# EAGLE design GroundStation (EAGLE 7.7.0)
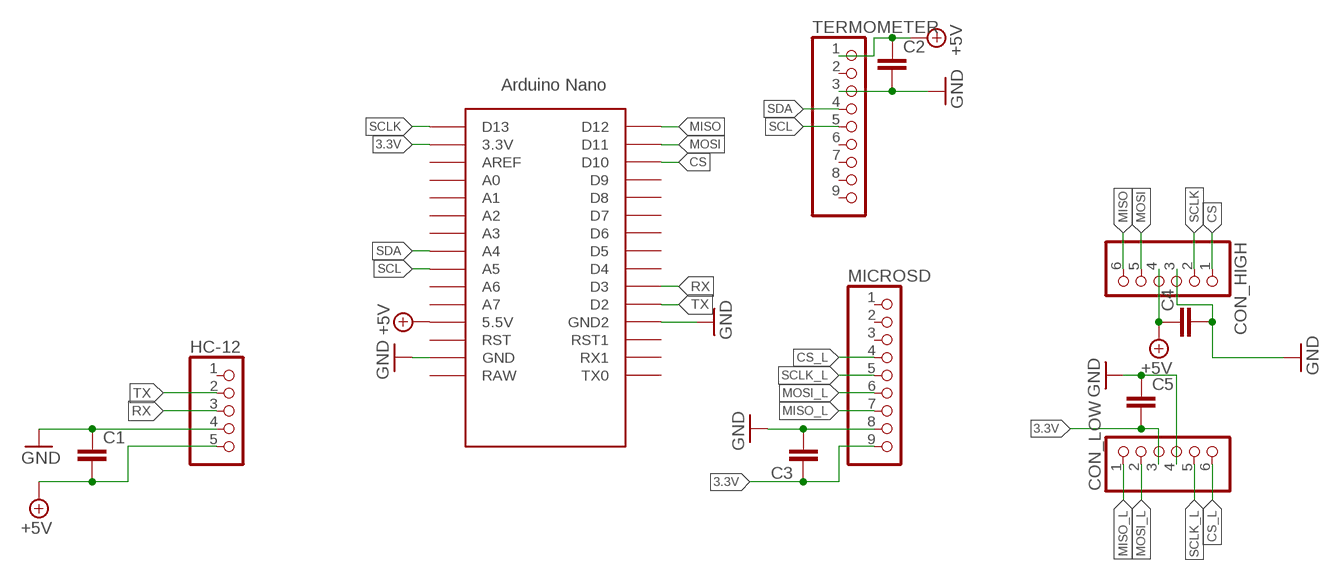
[diagram p0: schematic, sheet 1]

## Parts
C1  C-EU050-025X075  [C050-025X075]
C2  C-EU050-025X075  [C050-025X075]
C3  C-EU050-025X075  [C050-025X075]
C4  C-EU050-025X075  [C050-025X075]
C5  C-EU050-025X075  [C050-025X075]
CON_HIGH  PINHD-1X6  [1X06]
CON_LOW  PINHD-1X6  [1X06]
HC-12  PINHD-1X5  [1X05]
MICROSD  PINHD-1X9  [1X09]
TERMOMETER  PINHD-1X9  [1X09]
U$1  NANO  [NANO]

## Nets
3.3V: C3.1 C5.2 CON_LOW.3 MICROSD.9 U$1.3.3V
+5V: C1.2 C2.1 C4.1 CON_HIGH.4 HC-12.5 TERMOMETER.1 U$1.5V(5.5V)
CS: CON_HIGH.1 U$1.D10
CS_L: CON_LOW.6 MICROSD.4
GND: C1.1 C2.2 C3.2 C4.2 C5.1 CON_HIGH.3 CON_LOW.4 HC-12.4 MICROSD.8 TERMOMETER.3 U$1.GND U$1.GND1(GND2)
MISO: CON_HIGH.6 U$1.D12
MISO_L: CON_LOW.1 MICROSD.7
MOSI: CON_HIGH.5 U$1.D11
MOSI_L: CON_LOW.2 MICROSD.6
RX: HC-12.3 U$1.D3
SCL: TERMOMETER.5 U$1.A5
SCLK: CON_HIGH.2 U$1.D13
SCLK_L: CON_LOW.5 MICROSD.5
SDA: TERMOMETER.4 U$1.A4
TX: HC-12.2 U$1.D2
Unconnected: HC-12.1 MICROSD.1 MICROSD.2 MICROSD.3 TERMOMETER.2 TERMOMETER.6 TERMOMETER.7 TERMOMETER.8 TERMOMETER.9 U$1.A0 U$1.A1 U$1.A2 U$1.A3 U$1.A6 U$1.A7 U$1.AREF U$1.D4 U$1.D5 U$1.D6 U$1.D7 U$1.D8 U$1.D9 U$1.ICSP1 U$1.ICSP2 U$1.ICSP3 U$1.ICSP4 U$1.ICSP5 U$1.ICSP6 U$1.RAW U$1.RST U$1.RST1 U$1.RX1 U$1.TX0

## Library data of the parts
C1-C5 = resistor:C-EU: CAPACITOR, European symbol
CON_HIGH CON_LOW = pinhead:PINHD-1X6: PIN HEADER
HC-12 = pinhead:PINHD-1X5: PIN HEADER
MICROSD TERMOMETER = pinhead:PINHD-1X9: PIN HEADER
U$1 = Arduino-clone:NANO: Arduino Nano

## Board
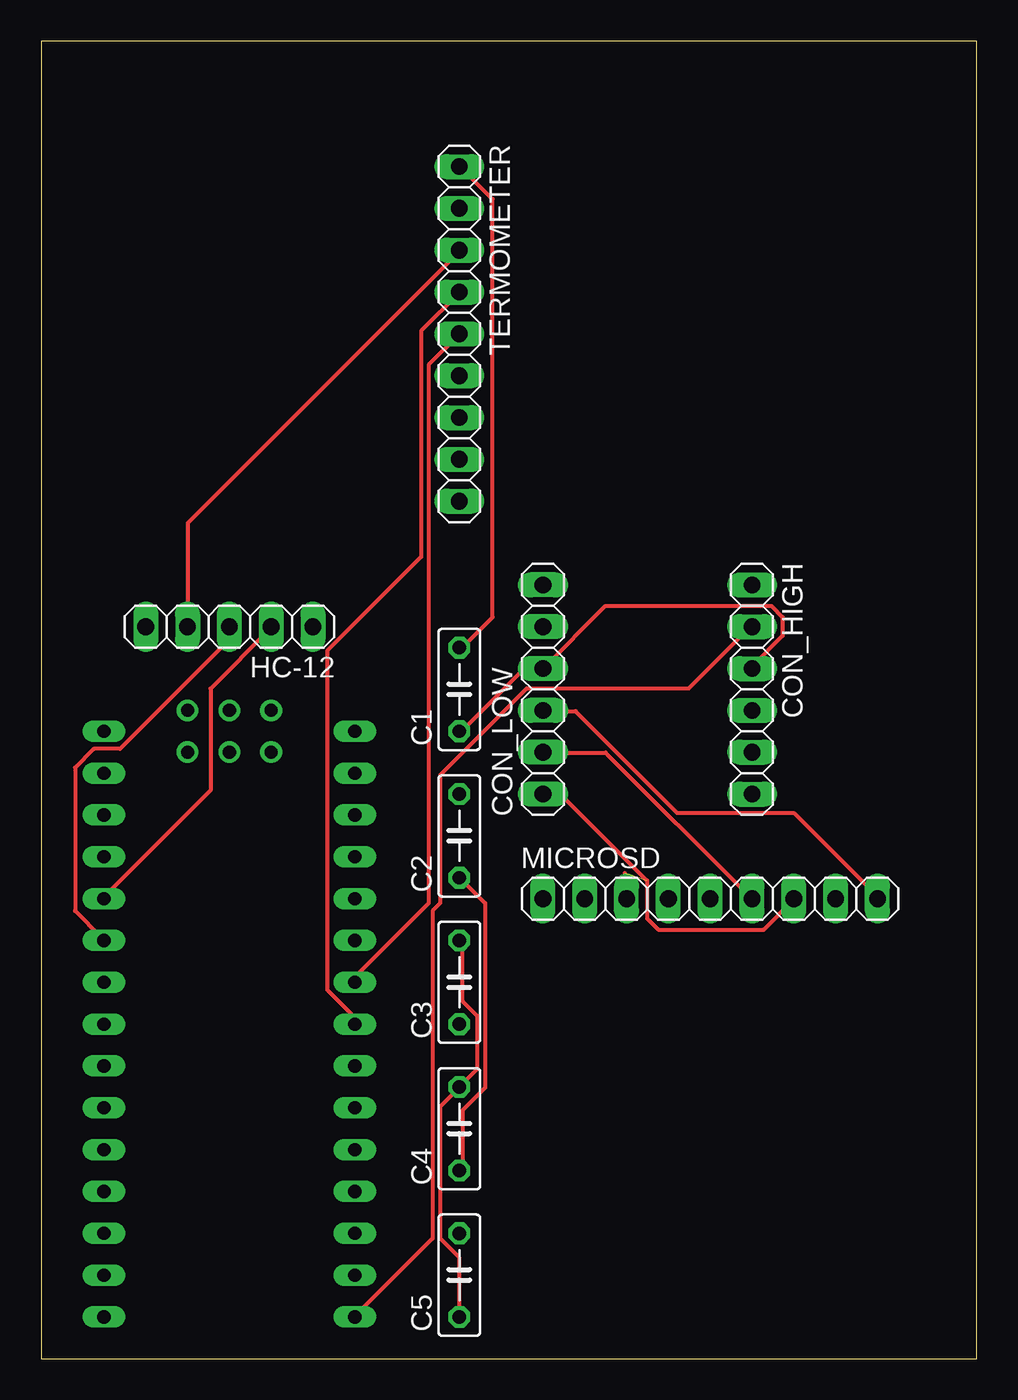
[diagram p1: board, top side]
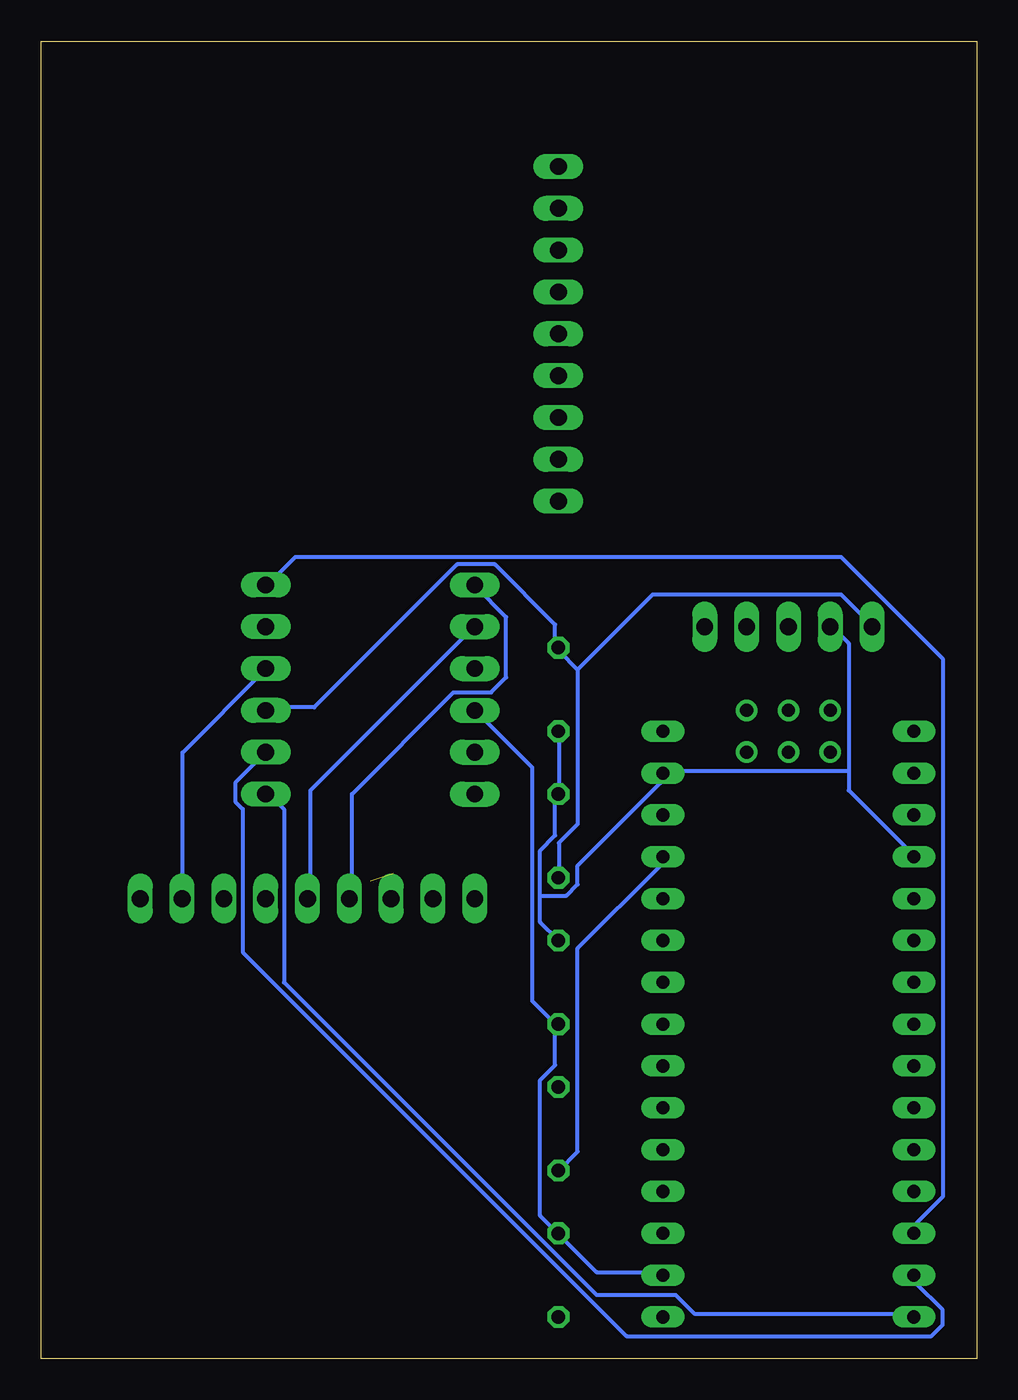
[diagram p2: board, bottom side, seen from below]

Size 56.82 x 80 mm. Coordinates in mm from the lower left corner, seen from the top.
Outline: 0,0 56.82,0 56.82,80 0,80 0,0
Copper layers (1*16): Top 0.035mm / dielectric 1.5mm / Bottom 0.035mm
Design rules "default": minimum track width 10mil, minimum drill 24mil, track to track 8mil, track to pad 8mil, pad to pad 8mil, via to via 8mil, smd to smd 8mil, copper to edge 40mil, drill to drill 8mil, minimum pad ring 10mil, minimum via ring 8mil, stop-mask expansion 4mil, vias tented up to drill 0mil, thermal gap 10mil

### Footprints (pad centres in the part's own frame; a part is rotated, then mirrored left to right if it is on the bottom)
C050-025X075 = drill 0.813 octagon: 1 -2.54,0; 2 2.54,0
1X06 = drill 1.016 long: 1 -6.35,0; 2 -3.81,0; 3 -1.27,0; 4 1.27,0; 5 3.81,0; 6 6.35,0
1X05 = drill 1.016 long: 1 -5.08,0; 2 -2.54,0; 3 0,0; 4 2.54,0; 5 5.08,0
1X09 = drill 1.016 long: 1 -10.16,0; 2 -7.62,0; 3 -5.08,0; 4 -2.54,0; 5 0,0; 6 2.54,0; 7 5.08,0; 8 7.62,0; 9 10.16,0
NANO = drill 0.8 long: 3.3V -10.16,24.13; 5V -10.16,-1.27; A0 -10.16,19.05; A1 -10.16,16.51; A2 -10.16,13.97; A3 -10.16,11.43; A4 -10.16,8.89; A5 -10.16,6.35; A6 -10.16,3.81; A7 -10.16,1.27; AREF -10.16,21.59; D2 5.08,1.27; D3 5.08,3.81; D4 5.08,6.35; D5 5.08,8.89; D6 5.08,11.43; D7 5.08,13.97; D8 5.08,16.51; D9 5.08,19.05; D10 5.08,21.59; D11 5.08,24.13; D12 5.08,26.67; D13 -10.16,26.67; GND -10.16,-6.35; GND1 5.08,-1.27; RAW -10.16,-8.89; RST -10.16,-3.81; RST1 5.08,-3.81; RX1 5.08,-6.35; TX0 5.08,-8.89 | drill 0.8: ICSP1 -5.08,-10.16; ICSP2 -5.08,-7.62; ICSP3 -2.54,-10.16; ICSP4 -2.54,-7.62; ICSP5 0,-10.16; ICSP6 0,-7.62

### Placement (x,y rotation side)
C1  25.4,40.64 90 top
C2  25.4,31.75 90 top
C3  25.4,22.86 90 top
C4  25.4,13.97 90 top
C5  25.4,5.08 90 top
CON_HIGH  43.18,40.64 270 top
CON_LOW  30.48,40.64 90 top
HC-12  11.43,44.45 180 top
MICROSD  40.64,27.94 0 top
TERMOMETER  25.4,62.23 270 top
U$1  8.89,29.21 180 top

### Tracks (layer width: path | path; a pad name or v marks a point on that pad's centre or on a via)
3.3V
  Top 0.254: MICROSD.9 50.75,28.12 45.72,33.15 38.63,33.15 32.46,39.32 30.63,39.32 CON_LOW.3
  Bottom 0.254: U$1.3.3V 19.2,5.26 23.09,5.26 25.38,7.54 C5.2 25.6,7.77 26.52,8.69 26.52,16.92 25.6,17.83 25.6,20.12 C3.1 25.6,20.34 26.98,21.72 26.98,35.89 30.4,39.32 CON_LOW.3
+5V
  Top 0.254: TERMOMETER.1 25.6,72.24 27.43,70.41 27.43,45.03 25.6,43.2 C1.2 | C4.1 25.6,11.43 25.6,15.09 26.98,16.46 26.98,27.66 25.6,29.03 C2.1
  Bottom 0.254: U$1.5V 19.2,30.4 19.2,29.95 24.23,24.92 24.23,12.57 25.38,11.43 C4.1 | 24.23,41.83 24.23,32.46 25.38,31.32 25.38,29.26 C2.1 | 24.23,41.83 25.38,42.98 C1.2 25.6,43.2 25.6,44.58 29.26,48.23 31.55,48.23 40.23,39.55 42.98,39.55 CON_HIGH.4 | 24.23,41.83 19.66,46.41 8.23,46.41 6.4,44.58 HC-12.5
CS
  Bottom 0.254: U$1.D10 3.66,7.77 3.66,8.23 2.06,9.83 2.06,42.52 8.23,48.69 41.38,48.69 42.98,47.09 CON_HIGH.1
CS_L
  Bottom 0.254: CON_LOW.6 30.4,46.86 28.57,45.03 28.57,41.38 29.49,40.46 31.77,40.46 37.95,34.29 37.95,28.12 MICROSD.4
GND
  Top 0.254: TERMOMETER.3 25.38,67.21 8.91,50.75 8.91,44.58 HC-12.4 | C1.1 25.6,38.18 29.26,41.83 30.4,41.83 CON_LOW.4 34.29,45.72 44.35,45.72 45.03,45.03 45.03,43.89 43.2,42.06 CON_HIGH.3 | C5.1 25.38,2.74 25.38,6.17 24.23,7.32 24.23,15.32 25.38,16.46 C4.2 25.6,16.69 26.52,17.6 26.52,20.8 25.6,21.72 25.6,25.38 C3.2
  Bottom 0.254: 7.77,35.66 7.77,43.43 8.69,44.35 HC-12.4 | 7.77,35.66 7.77,34.52 3.89,30.63 U$1.GND1 | 7.77,35.66 18.97,35.66 U$1.GND 19.2,35.43 19.2,34.98 24.23,29.95 24.23,28.8 24.92,28.12 26.52,28.12 | CON_HIGH.3 43.2,41.83 48.23,36.8 48.23,28.12 MICROSD.8 | C1.1 25.38,37.95 25.38,34.29 C2.2 25.6,34.29 25.6,31.77 26.52,30.86 26.52,28.12 | 26.52,28.12 26.52,26.52 C3.2
MISO
  Bottom 0.254: U$1.D12 3.89,2.74 17.14,2.74 18.29,3.89 23.09,3.89 42.06,22.86 42.06,33.38 42.98,34.29 CON_HIGH.6
MISO_L  (via drill 0.6)  (1 unrouted)
  Top 0.254: 35.43,29.49 v35.43,28.12 | MICROSD.7 45.72,27.89 43.89,26.06 37.49,26.06 36.8,26.75 36.8,29.03 31.55,34.29 30.63,34.29 CON_LOW.1
MOSI
  Bottom 0.254: CON_HIGH.5 45.03,34.98 45.03,33.83 44.58,33.38 44.58,24.69 21.26,1.37 2.74,1.37 2.06,2.06 2.06,2.97 3.66,4.57 3.66,5.03 U$1.D11
MOSI_L
  Top 0.254: MICROSD.6 42.98,28.12 34.29,36.8 30.63,36.8 CON_LOW.2
RX
  Top 0.254: HC-12.3 11.43,43.66 4.8,37.03 3.2,37.03 2.06,35.89 2.06,27.2 3.66,25.6 U$1.D3
SCL
  Top 0.254: U$1.A5 19.2,22.86 19.2,23.32 23.55,27.66 23.55,60.35 25.38,62.18 TERMOMETER.5
SCLK
  Top 0.254: U$1.D13 19.2,2.74 23.77,7.32 23.77,27.2 24.23,27.66 24.23,35.43 29.49,40.69 39.32,40.69 42.98,44.35 CON_HIGH.2
SCLK_L
  Bottom 0.254: CON_LOW.5 30.63,44.35 40.46,34.52 40.46,28.12 MICROSD.5
SDA
  Top 0.254: U$1.A4 18.97,20.34 18.97,20.8 17.37,22.4 17.37,42.98 23.09,48.69 23.09,62.41 25.38,64.69 TERMOMETER.4
TX
  Top 0.254: U$1.D2 3.89,28.12 10.29,34.52 10.29,40.69 13.95,44.35 HC-12.2